# EAGLE design arduinoshield (EAGLE 9.6.2)
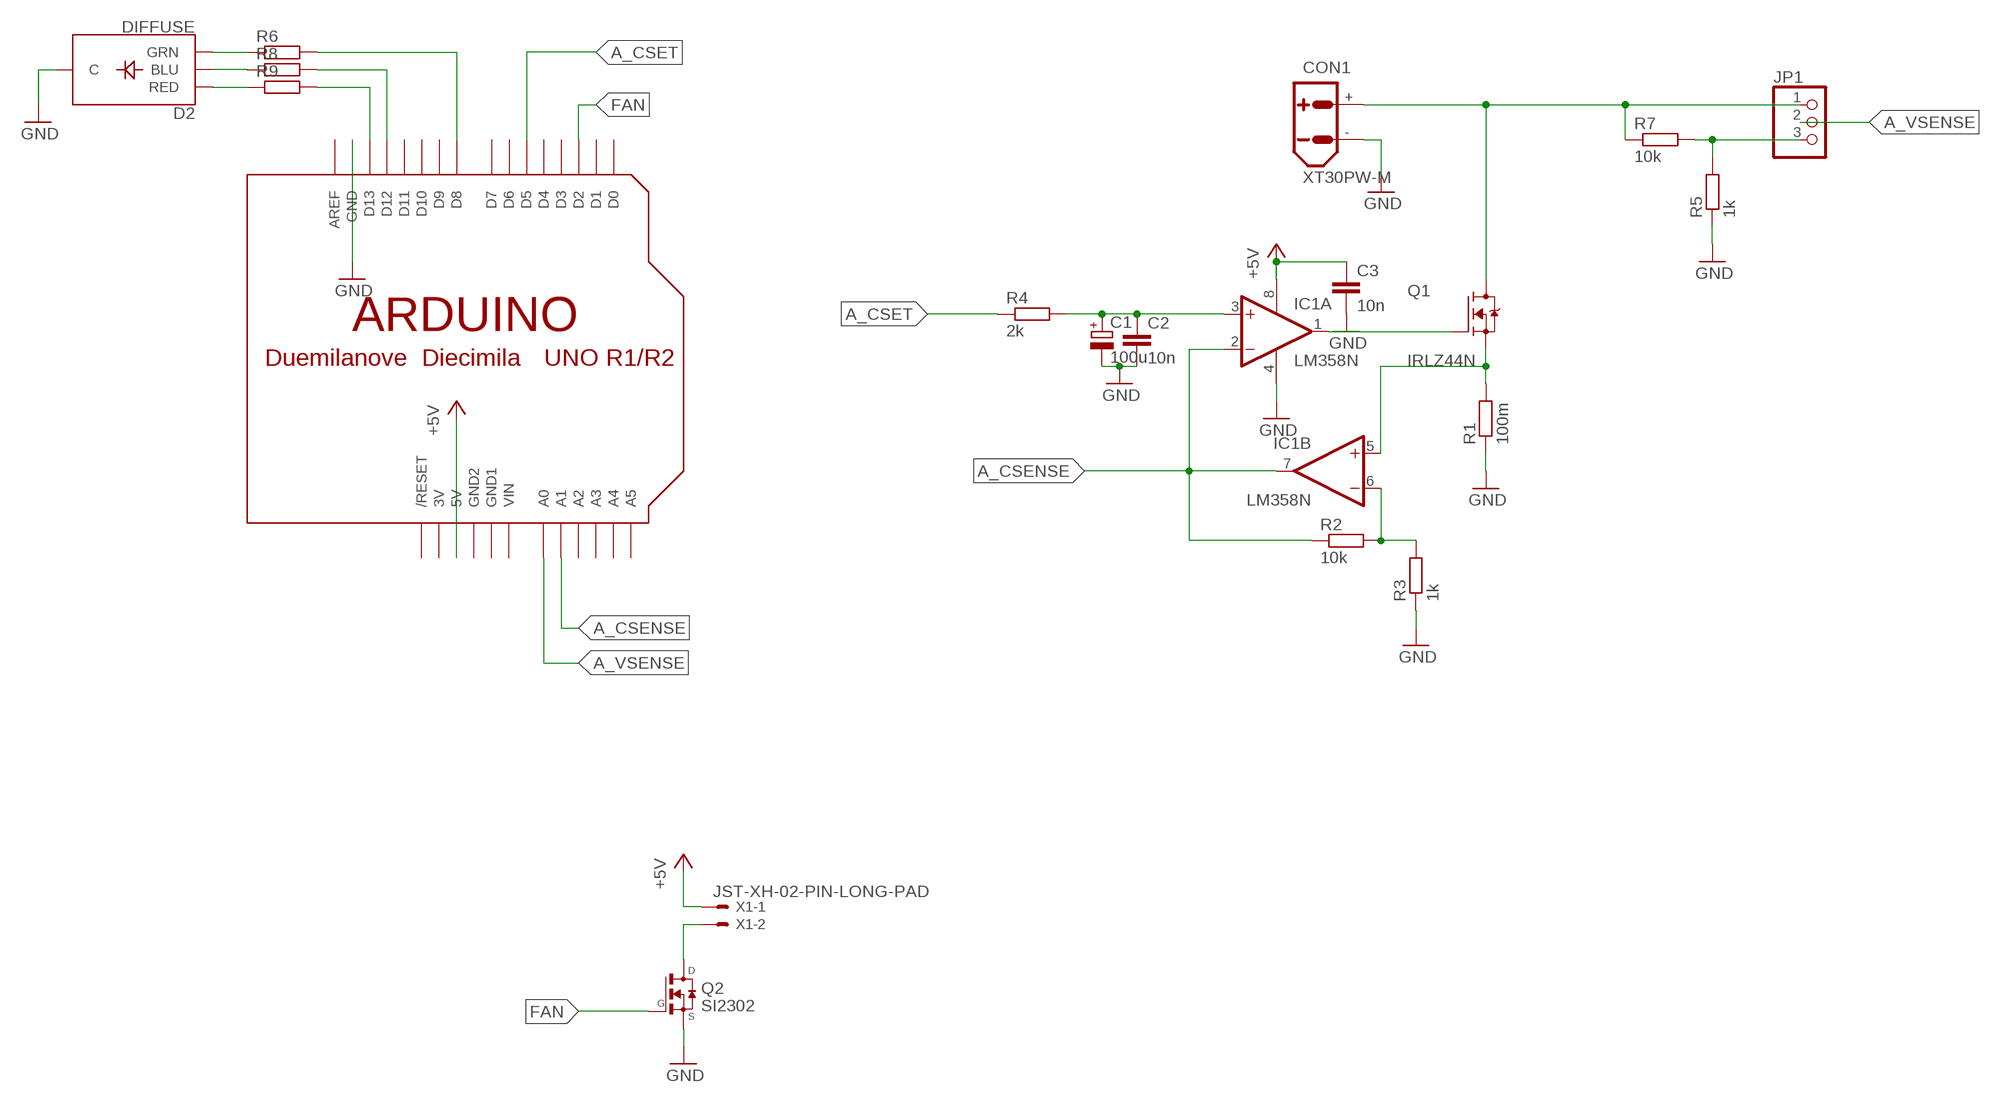
[diagram p0: schematic, sheet 1]

## Parts
C1  100u  CPOL-EUE2.5-7  [E2,5-7]
C2  10n  C-EU050-025X075  [C050-025X075]
C3  10n  C-EU050-025X075  [C050-025X075]
CON1  XT30PW-M  [XT30PW-M]
D2  DIFFUSE  LED-RGB-CCDIFFUSE  [LED-RGB-THRU]
IC1  LM358N  [DIL08]
JP1  PINHD-1X3  [1X03]
Q1  IRLZ44N  [TO254P1054X469X1930-3]
Q2  SI2302  [SOT23]
R1  100m  R-EU_R2512  [R2512]
R2  10k  R-EU_M1206  [M1206]
R3  1k  R-EU_M1206  [M1206]
R4  2k  R-EU_M1206  [M1206]
R5  1k  R-EU_M1206  [M1206]
R6  R-EU_M1206  [M1206]
R7  10k  R-EU_M1206  [M1206]
R8  R-EU_M1206  [M1206]
R9  R-EU_M1206  [M1206]
U$2  ARDUINO-NOHOLE  [ARDUINO-NOHOLE]
X1  JST-XH-02-PIN-LONG-PAD  [JST-XH-02-PACKAGE-LONG-PAD]

## Nets
+5V: C3.1 IC1.8(P:V+) U$2.5V X1.1
A_CSENSE: IC1.2(A:-IN) IC1.7(B:OUT) R2.1 U$2.A1
A_CSET: R4.1 U$2.D5
A_VSENSE: JP1.2 U$2.A0
FAN: Q2.1(G) U$2.D2
GND: C1.- C2.2 C3.2 CON1.- D2.2(C) IC1.4(P:V-) Q2.2(S) R1.1 R3.1 R5.1 U$2.GND
N$1: IC1.5(B:+IN) Q1.3(S) R1.2
N$2: CON1.+ JP1.1 Q1.2(D) R7.1
N$3: JP1.3 R5.2 R7.2
N$4: IC1.1(A:OUT) Q1.1(G)
N$5: C1.+ C2.1 IC1.3(A:+IN) R4.2
N$6: IC1.6(B:-IN) R2.2 R3.2
N$7: Q2.3(D) X1.2
N$8: D2.3(GRN) R6.1
N$9: D2.4(BLU) R8.1
N$10: D2.1(RED) R9.1
N$12: R6.2 U$2.D8
N$13: R8.2 U$2.D12
N$14: R9.2 U$2.D13
Unconnected: U$2.A2 U$2.A3 U$2.A4 U$2.A5 U$2.AREF U$2.D0 U$2.D1 U$2.D3 U$2.D4 U$2.D6 U$2.D7 U$2.D9 U$2.D10 U$2.D11 U$2.RESET(/RESET)

## Power pins joined to a net without a drawn wire
3V: U$2.3V
GND1: U$2.GND1
GND2: U$2.GND2
VIN: U$2.VIN

## Library data of the parts
C1 = rcl:CPOL-EU: POLARIZED CAPACITOR, European symbol; SPICEPREFIX: C
C2 C3 = rcl:C-EU: CAPACITOR, European symbol; SPICEPREFIX: C
CON1 = amass:XT30: AMASS XT30 connector Store in Japan AMASS XT30 connector <https://szc.jp/ams-xt30>
D2 = SparkFun-LED:LED-RGB-CC: LED-RGB Common Cathode Packages: LED RGB-THRU LED_PIRANHA_5MM SparkFun Products: RGB Diffused Common Cathode- Diffuse <[https://www.sparkfun.com/products/9264]> RGB Diffused Common Cathode - Clear <[https://www.sparkfun.com/products/105]> LED-RGB 5mm Square (Piranha) <[https://www.sparkfun.com/products/11679]>; PROD_ID: DIO-09434
IC1 = linear:LM358: OP AMP also LM158; LM258; LM2904 Source: http://cache.national.com/ds/LM/LM158.pdf
JP1 = adafruit:PINHD-1X3: PIN HEADER
Q1 = IRLZ44N:IRLZ44N: 55V Single N-Channel HEXFET Power MOSFET in a TO-220AB package Check availability <https://pricing.snapeda.com/parts/IRLZ44N/Infineon%20Technologies/view-part?ref=eda>; AVAILABILITY: In Stock; DESCRIPTION: N-Channel 55 V 47A (Tc) 3.8W (Ta), 110W (Tc) Surface Mount D2PAK; MF: Infineon Technologies; MP: IRLZ44N; PACKAGE: TO-220 Infineon; PRICE: None; PURCHASE-URL: https://pricing.snapeda.com/search/part/IRLZ44N/?ref=eda
Q2 = SI2302:SI2302: MOSFET N-Channel 20 V (D-S) Check availability <https://pricing.snapeda.com/parts/SI2302/Vishay%20Siliconix/view-part?ref=eda>; AVAILABILITY: In Stock; DESCRIPTION: N-Channel 20 V 2.9A (Tj) 710mW (Ta) Surface Mount SOT-23-3 (TO-236); MF: Vishay Siliconix; MP: SI2302; PACKAGE: SOT-23-3 Vishay Siliconix; PRICE: None; PURCHASE-URL: https://pricing.snapeda.com/search/part/SI2302/?ref=eda
R1-R9 = rcl:R-EU_: RESISTOR, European symbol; SPICEPREFIX: R
U$2 = adafruit:ARDUINO: Arduino Diecimila/Duemilanove Make a shield with ease, this package has all the named pins as well as the two mounting drill holes and an outline of the USB and DC power connector. The outline is on the DIMENSION layer, so if your board house uses it they will cut the outline to match. http://www.ladyada.net/library/pcb/eaglelibrary.html
X1 = Rembrandt Electronics - JST XH Connectors v1-0:JST-XH-02-PIN: JST XH Connector 2 Pin Wire to board connector. Pitch: 2,54 mm, (0.100") Number of pins: 2 Created by Rembrandt Electronics www.rembrandtelectronics.com

## Board
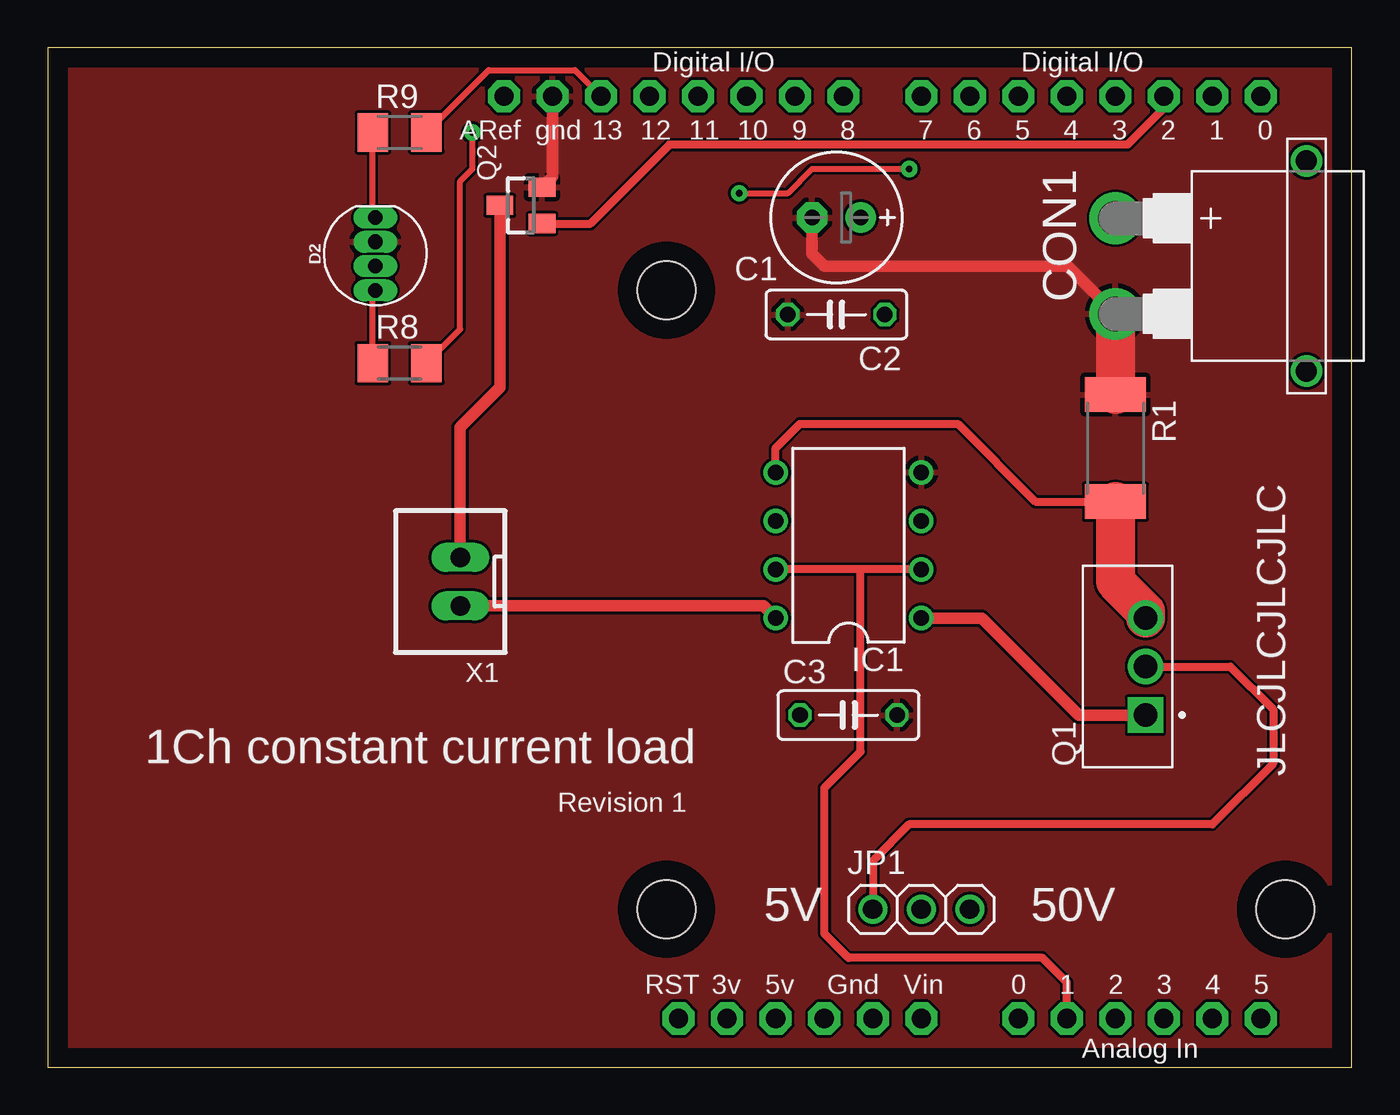
[diagram p1: board, top side]
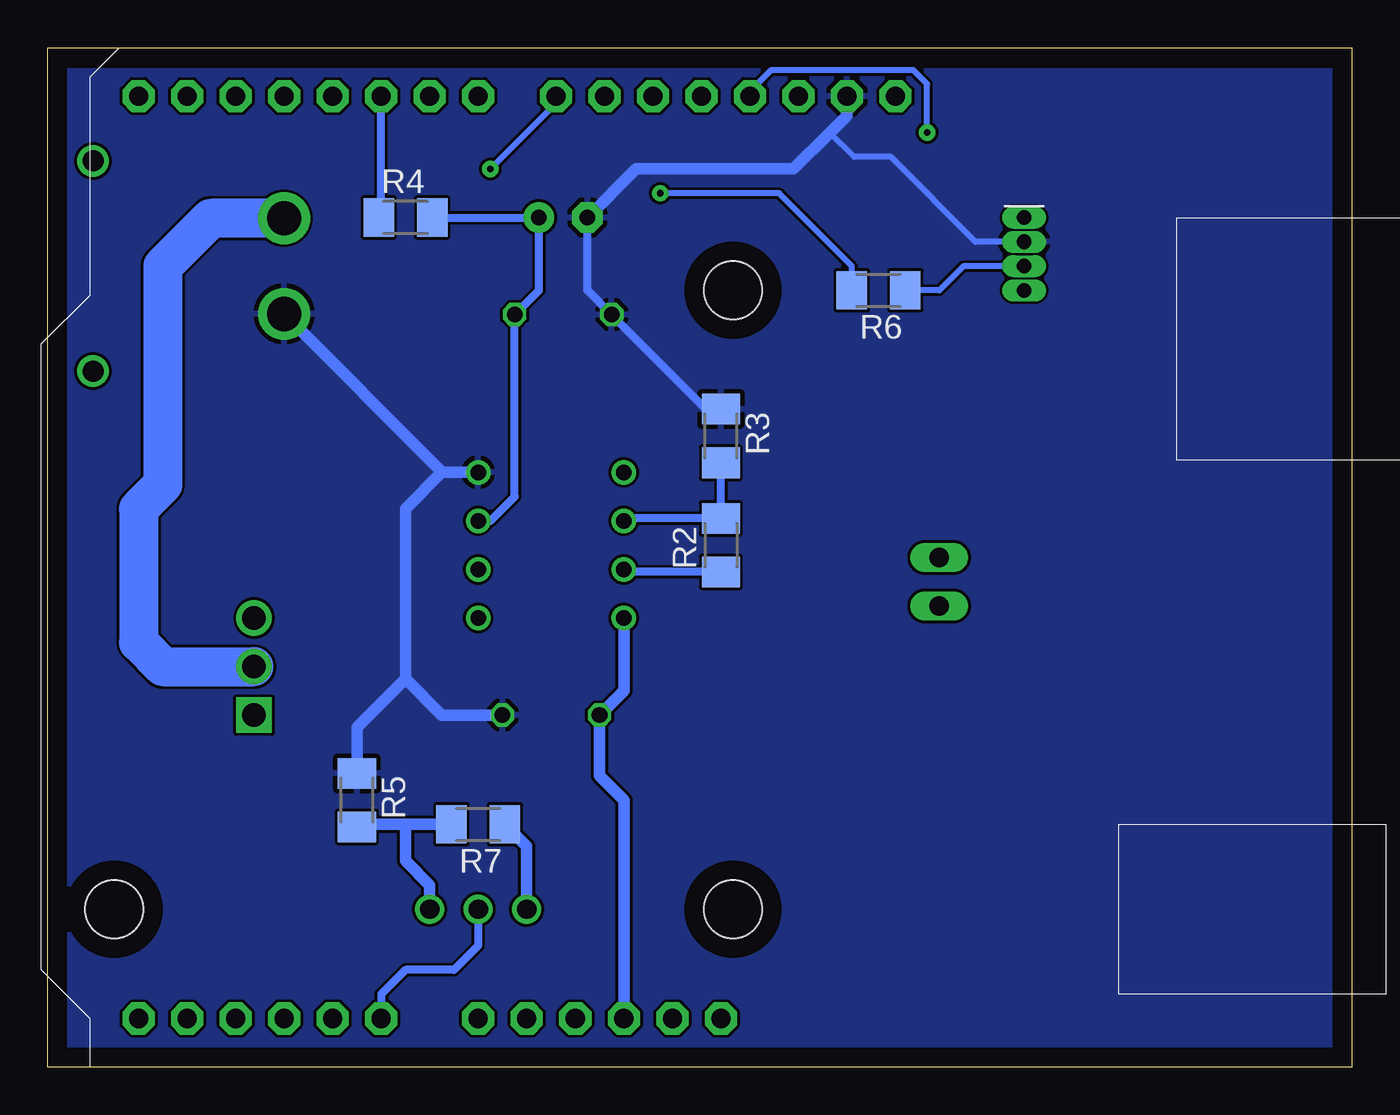
[diagram p2: board, bottom side, seen from below]

Size 68.25 x 53.33 mm. Coordinates in mm from the lower left corner, seen from the top.
Outline: 0,0 68.25,0 68.25,53.33 0,53.33 0,0
Copper layers (1*16): Top 0.035mm / dielectric 1.5mm / Bottom 0.035mm
Design rules "default *": minimum track width 6mil, minimum drill 0.35mm, track to track 6mil, track to pad 6mil, pad to pad 4mil, via to via 6mil, smd to smd 6mil, copper to edge 40mil, drill to drill 6mil, minimum pad ring 6mil, minimum via ring 10mil, stop-mask expansion 4mil, vias tented up to drill 0mil, thermal gap 10mil
Holes 3.05 mm at 64.77,8.26 32.38,8.26 32.38,40.64

### Footprints (pad centres in the part's own frame; a part is rotated, then mirrored left to right if it is on the bottom)
E2,5-7 = drill 0.813 pad 1.6: + -1.27,0 | drill 0.813 pad 1.6 octagon: - 1.27,0
C050-025X075 = drill 0.813 octagon: 1 -2.54,0; 2 2.54,0
XT30PW-M = drill 1.8: + -2.5,0; - 2.5,0 | drill 1.1: P$3 -5.5,10; P$4 5.5,10
LED-RGB-THRU = drill 0.762 pad 0.889 long: 1 1.905,0; 2 0.635,0; 3 -0.635,0; 4 -1.905,0
DIL08 = drill 0.813 pad 1.27: 1 -3.81,-3.81; 2 -1.27,-3.81; 3 1.27,-3.81; 4 3.81,-3.81; 5 3.81,3.81; 6 1.27,3.81; 7 -1.27,3.81; 8 -3.81,3.81
1X03 = drill 1.016: 1 -2.54,0; 2 0,0; 3 2.54,0
TO254P1054X469X1930-3 = drill 1.23 pad 1.85 square: 1 -2.54,-0.94 | drill 1.23 pad 1.85: 2 0,-0.94; 3 2.54,-0.94
SOT23 = smd 1 x 1.4: 1 -0.95,-1.1; 2 0.95,-1.1; 3 0,1.1
R2512 = smd 1.8 x 3.2: 1 -2.8,0; 2 2.8,0
M1206 = smd 1.6 x 2: 1 -1.4,0; 2 1.4,0
ARDUINO-NOHOLE = drill 1 pad 1.676 octagon: 3V 35.56,2.54; 5V 38.1,2.54; A0 50.8,2.54; A1 53.34,2.54; A2 55.88,2.54; A3 58.42,2.54; A4 60.96,2.54; A5 63.5,2.54; AREF 23.876,50.8; D0 63.5,50.8; D1 60.96,50.8; D2 58.42,50.8; D3 55.88,50.8; D4 53.34,50.8; D5 50.8,50.8; D6 48.26,50.8; D7 45.72,50.8; D8 41.656,50.8; D9 39.116,50.8; D10 36.576,50.8; D11 34.036,50.8; D12 31.496,50.8; D13 28.956,50.8; GND 26.416,50.8; GND1 43.18,2.54; GND2 40.64,2.54; RESET 33.02,2.54; VIN 45.72,2.54
JST-XH-02-PACKAGE-LONG-PAD = drill 1.016 long: 1 -1.27,0; 2 1.27,0

### Placement (x,y rotation side)
C1  41.27,44.45 180 top
C2  41.27,39.37 180 top
C3  41.91,18.41 0 top
CON1  55.88,41.91 270 top
D2  17.14,42.55 90 top
IC1  41.91,27.3 90 top
JP1  45.72,8.26 0 top
Q1  56.52,20.95 90 top
Q2  24.77,45.09 90 top
R1  55.88,32.38 270 top
R2  33.02,27.3 90 bottom
R3  33.02,33.02 270 bottom
R4  49.53,44.45 0 bottom
R5  52.07,13.97 270 bottom
R6  24.77,40.64 180 bottom
R7  45.72,12.7 180 bottom
R8  18.41,36.83 0 top
R9  18.41,48.9 0 top
U$2  0,0 0 top
X1  21.59,25.4 90 top

### Tracks (layer width: path | path; a pad name or v marks a point on that pad's centre or on a via)
+5V
  Top 0.61: IC1.8 37.47,24.13 X1.1
  Bottom 0.61: U$2.5V 38.1,13.97 39.37,15.24 C3.1 38.1,19.68 IC1.8
A_CSENSE
  Top 0.406: IC1.2 42.55,26.04 | 42.55,26.04 IC1.7 | U$2.A1 53.34,4.45 52.07,5.71 41.91,5.71 40.64,6.99 40.64,14.61 42.55,16.51 42.55,26.04
  Bottom 0.406: R2.1 37.97,25.91 IC1.7
A_CSET
  Bottom 0.406: R4.1 50.8,44.58 U$2.D5
A_VSENSE
  Bottom 0.406: JP1.2 45.72,6.35 46.99,5.08 49.53,5.08 50.8,3.81 U$2.A0
FAN
  Top 0.406: Q2.1 28.41,44.13 32.53,48.26 56.52,48.26 58.42,50.16 U$2.D2
GND
  Top 0.61: U$2.GND 26.42,46.59 Q2.2 | C1.- 40.01,42.55 40.64,41.91 53.38,41.91 CON1.-
  Top 2.032: CON1.- R1.1
  Bottom 0.305: D2.2 19.68,43.18 24.13,47.62 26.04,47.62 27.3,48.9
  Bottom 0.406: C1.- 40.01,40.64 C2.2 33.78,34.42 R3.1
  Bottom 0.61: IC1.4 47.62,31.11 | 47.62,31.11 49.53,29.21 49.53,20.32 | 49.53,20.32 47.62,18.41 C3.2 | 49.53,20.32 52.07,17.78 R5.1 | 47.62,31.11 47.62,31.16 CON1.- | C1.- 37.47,46.99 29.21,46.99 27.3,48.9 26.42,49.78 U$2.GND
  pour Top: 0.64,0.64 0.64,52.7 67.94,52.7 67.94,0.64
  pour Bottom: 0.64,52.7 0.64,0.64 67.94,0.64 67.94,52.7
N$1
  Top 0.406: IC1.5 38.1,32.38 39.37,33.66 47.62,33.66 51.7,29.59 R1.2
  Top 2.032: R1.2 55.88,25.4 57.45,23.82 Q1.3
N$2
  Top 0.406: Q1.2 61.9,20.95 64.14,18.72 64.14,15.88 60.96,12.7 45.09,12.7 43.18,10.79 JP1.1
  Bottom 0.61: R7.1 43.18,11.56 JP1.1
  Bottom 2.032: CON1.+ 59.73,44.41 62.23,41.91 62.23,30.48 63.5,29.21 63.5,22.23 62.23,20.95 Q1.2
N$3
  Bottom 0.61: R7.2 49.53,12.7 | 49.53,12.7 51.94,12.7 R5.2 | JP1.3 48.26,9.53 49.53,10.79 49.53,12.7
N$4
  Top 0.61: IC1.1 48.9,23.5 53.98,18.41 Q1.1
N$5
  Bottom 0.406: IC1.3 45.09,28.57 43.81,29.84 C2.1 42.55,40.64 C1.+ R4.2
N$6
  Bottom 0.406: IC1.6 37.97,28.7 R2.2 R3.2
N$7
  Top 0.61: Q2.3 23.66,35.56 21.59,33.48 X1.2
N$8
  Bottom 0.305: D2.3 20.32,41.91 21.59,40.64 R6.1
N$9
  Top 0.305: R8.1 17.02,40.51 D2.4
N$10
  Top 0.305: D2.1 17.02,44.58 R9.1
N$12  (via drill 0.35)
  Top 0.305: v36.2,45.72 38.73,45.72 40.01,46.99 v45.09,46.99
  Bottom 0.305: 41.66,50.55 U$2.D8 41.66,50.42 v45.09,46.99 | R6.2 26.16,41.91 29.98,45.72 v36.2,45.72
N$13  (via drill 0.35)
  Top 0.305: R8.2 21.59,38.6 21.59,46.35 22.23,46.99 v22.23,48.9
  Bottom 0.305: 31.5,50.16 U$2.D12 31.5,51.05 30.39,52.16 22.95,52.16 22.23,51.44 v22.23,48.9
N$14
  Top 0.305: R9.2 23.08,52.16 27.59,52.16 U$2.D13

### Text on the board
tNames: JLCJLCJLCJLC
tSilk: 1Ch constant current load | Revision 1 | 5V | 50V